# Altium schematic sheet Sensor.SchDoc
size A4; SheetNumber: 6; SheetTotal: 14
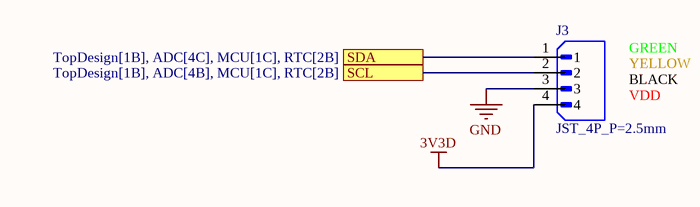
[diagram p0: Sensor.SchDoc]

## Parts
J3  JST_4P_P=2.5mm  [JST_4P_Straight_P=2.5mm]

## Ports
SCL (see TopDesign[1B], ADC[4B], MCU[1C], RTC[2B]), SDA (see TopDesign[1B], ADC[4C], MCU[1C], RTC[2B])

## Nets
3V3D: J3.4
GND: J3.3
SCL: J3.2 ; port SCL
SDA: J3.1 ; port SDA

## Notes on the sheet
- GREEN
- YELLOW
- BLACK
- VDD

## Library data of the parts
J3 = JST_4P_P=2.5mm: Connector Header Through Hole 4 position 0.098 (2.50mm); MF: JST Sales; MP: B4B-XH-A(LF)(SN); SnapEDA_Link: https://www.snapeda.com/parts/B4B-XH-A(LF)(SN)/JST+Sales+America+Inc./view-part/?ref=snap; Package: None; Value: *; Check_prices: https://www.snapeda.com/parts/B4B-XH-A(LF)(SN)/JST+Sales+America+Inc./view-part/?ref=eda